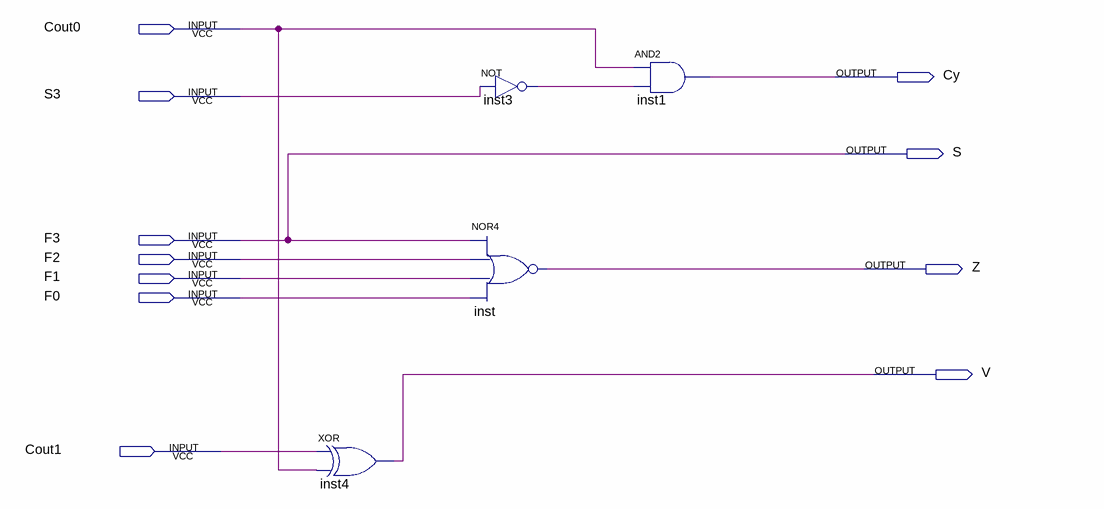
[diagram p0: schematic sheet]
// Quartus schematic state4bits.bdf as structural Verilog: 4 symbols, 11 pins
module state4bits (
  input  Cout0,
  input  S3,
  input  F3,
  input  F2,
  input  F1,
  input  F0,
  input  Cout1,
  output Cy,
  output S,
  output Z,
  output V
);

  wire inst3_out;

  xor inst4 (V, Cout1, Cout0);
  not inst3 (inst3_out, S3);
  nor inst (Z, F3, F2, F1, F0);
  and inst1 (Cy, Cout0, inst3_out);

  assign S = F3;
endmodule
